# EAGLE design 606_outin_ichigojam (EAGLE 8.2.2)
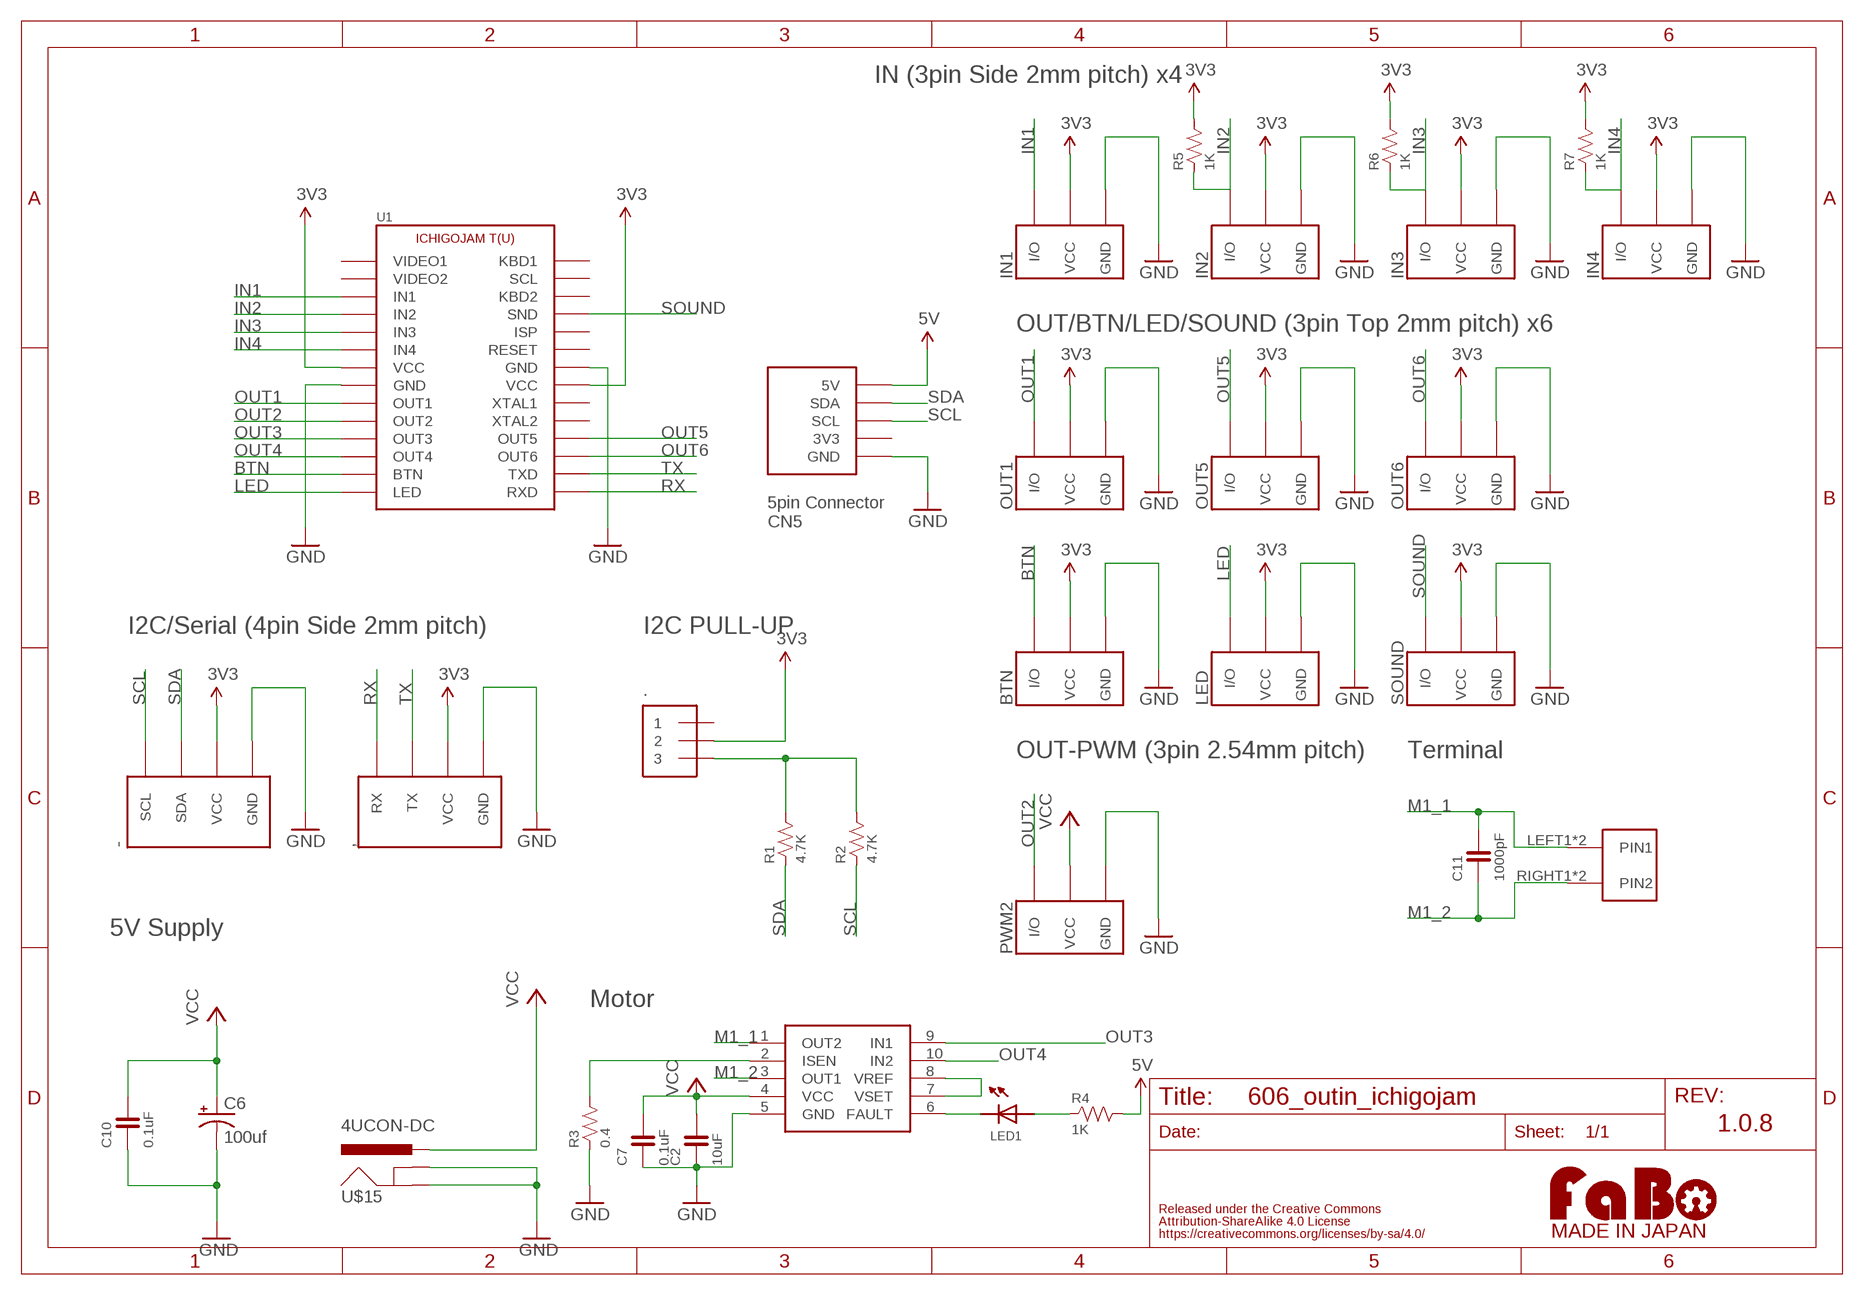
[diagram p0: schematic, sheet 1]

## Parts
,  FABO_BRICK_SERIAL-S04B-PASK-2_LONG  [FABO_BRICK_SERIAL_S04B-PASK-2_LONG]
-  FABO_BRICK_I2C-S04B-PASK-2_LONG  [FABO_BRICK_I2C_S04B-PASK-2_LONG]
.  PIN_HEADER_1X3  [PIN_1X3]
BTN  FABO_BRICK_3PIN-B03B-PASK-1  [FABO_BRICK_3PIN_B03B-PASK-1]
C2  10uF  CAPACITOR-0603  [0603]
C6  100uf  CPOL-US153CLV-0405  [153CLV-0405]
C7  0.1uF  CAPACITOR-0603  [0603]
C10  0.1uF  CAPACITOR-0603  [0603]
C11  1000pF  CAPACITOR-0603  [0603]
IN1  FABO_BRICK_3PIN-B03B-PASK-1  [FABO_BRICK_3PIN_B03B-PASK-1]
IN2  FABO_BRICK_3PIN-B03B-PASK-1  [FABO_BRICK_3PIN_B03B-PASK-1]
IN3  FABO_BRICK_3PIN-B03B-PASK-1  [FABO_BRICK_3PIN_B03B-PASK-1]
IN4  FABO_BRICK_3PIN-B03B-PASK-1  [FABO_BRICK_3PIN_B03B-PASK-1]
LED  FABO_BRICK_3PIN-B03B-PASK-1  [FABO_BRICK_3PIN_B03B-PASK-1]
LED1  LED-0603  [0603]
OUT1  FABO_BRICK_3PIN-B03B-PASK-1  [FABO_BRICK_3PIN_B03B-PASK-1]
OUT5  FABO_BRICK_3PIN-B03B-PASK-1  [FABO_BRICK_3PIN_B03B-PASK-1]
OUT6  FABO_BRICK_3PIN-B03B-PASK-1  [FABO_BRICK_3PIN_B03B-PASK-1]
PWM2  FABO_BRICK_3PIN-HEADER  [FABO_BRICK_3PIN_HEADER]
R1  4.7K  RESISTOR-0603  [0603]
R2  4.7K  RESISTOR-0603  [0603]
R3  0.4  RESISTOR-0603  [0603]
R4  1K  RESISTOR-0603  [0603]
R5  1K  RESISTOR-0603  [0603]
R6  1K  RESISTOR-0603  [0603]
R7  1K  RESISTOR-0603  [0603]
SOUND  FABO_BRICK_3PIN-B03B-PASK-1  [FABO_BRICK_3PIN_B03B-PASK-1]
U1  ICHIGOJAM_T-NOLABEL  [ICHIGOJAM_T_NOLABEL]
U$3  LOGO_FABO-M  [LOGO_FABO_MS]
U$6  DRV8832  [DRV8830]
U$12  ML-1400-S1  [ML-1400-S1]
U$15  4UCON-DC  [4UCON-DC]

## Nets
3V3: ,.VCC -.VCC ..2 BTN.VCC IN1.VCC IN2.VCC IN3.VCC IN4.VCC LED.VCC OUT1.VCC OUT5.VCC OUT6.VCC R5.2 R6.2 R7.2 SOUND.VCC U1.VCC1(VCC) U1.VCC2(VCC)
5V: R4.2 U1.5V
BTN: BTN.I/O U1.BTN
GND: ,.GND -.GND BTN.GND C2.1 C6.- C7.1 C10.1 IN1.GND IN2.GND IN3.GND IN4.GND LED.GND OUT1.GND OUT5.GND OUT6.GND PWM2.GND R3.1 SOUND.GND U1.GND1(GND) U1.GND2(GND) U1.GND3(GND) U$6.5(GND) U$15.GND1(GND) U$15.GND2(GNDBREAK)
GPIO21: LED1.CATHODE U$6.6(FAULT)
IN1: IN1.I/O U1.IN1
IN2: IN2.I/O R5.1 U1.IN2
IN3: IN3.I/O R6.1 U1.IN3
IN4: IN4.I/O R7.1 U1.IN4
LED: LED.I/O U1.LED
M1_1: C11.2 U$6.1(OUT2) U$12.LEFT1(PIN1) U$12.LEFT2(PIN1)
M1_2: C11.1 U$6.3(OUT1) U$12.RIGHT1(PIN2) U$12.RIGHT2(PIN2)
N$1: ..3 R1.2 R2.2
N$2: R3.2 U$6.2(ISEN)
N$3: U$6.7(VSET) U$6.8(VREF)
N$4: LED1.ANODE R4.1
OUT1: OUT1.I/O U1.OUT1
OUT2: PWM2.I/O U1.OUT2
OUT3: U1.OUT3 U$6.9(IN1)
OUT4: U1.OUT4 U$6.10(IN2)
OUT5: OUT5.I/O U1.OUT5
OUT6: OUT6.I/O U1.OUT6
RX: ,.RX U1.RXD
SCL: -.SCL R2.1 U1.SCL2(SCL)
SDA: -.SDA R1.1 U1.SDA
SOUND: SOUND.I/O U1.SND
TX: ,.TX U1.TXD
VCC: C2.2 C6.+ C7.2 C10.2 PWM2.VCC U$6.4(VCC) U$15.VCC(PWR)
Unconnected: ..1 U1.3V3 U1.ISP U1.KBD1 U1.KBD2 U1.RST(RESET) U1.SCL1(SCL) U1.VIDEO1 U1.VIDEO2 U1.XTAL1 U1.XTAL2

## Notes on the sheet
- IN (3pin Side 2mm pitch) x4
- OUT/BTN/LED/SOUND (3pin Top 2mm pitch) x6
- 5pin Connector
  CN5
- I2C/Serial (4pin Side 2mm pitch) | I2C PULL-UP
- OUT-PWM (3pin 2.54mm pitch) | Terminal
- 5V Supply
- Motor
- 1.0.8

## Library data of the parts
, = FaBo-Template:FABO_BRICK_SERIAL: FaBo Brick Serial
- = FaBo-Template:FABO_BRICK_I2C: FaBo Brick I2C
. = FaBo-PIN:PIN_HEADER_1X3
BTN IN1-IN4 LED OUT1 OUT5 OUT6 PWM2 SOUND = FaBo-Template:FABO_BRICK_3PIN: FaBo Brick 3pin
C2 C7 C10 C11 = FaBo-Capacitor:CAPACITOR: CAPACITOR
C6 = resistor:CPOL-US: POLARIZED CAPACITOR, American symbol
LED1 = FaBo-LED:LED
R1-R7 = FaBo-Resistors:RESISTOR: RESISTOR
U1 = FaBo-Boards:ICHIGOJAM_T
U$3 = FaBo-etc:LOGO_FABO
U$6 = FaBo-Motor:DRV8832
U$12 = FaBo-Terminal:ML-1400-S1
U$15 = FaBo-Supply:4UCON-DC

## Board
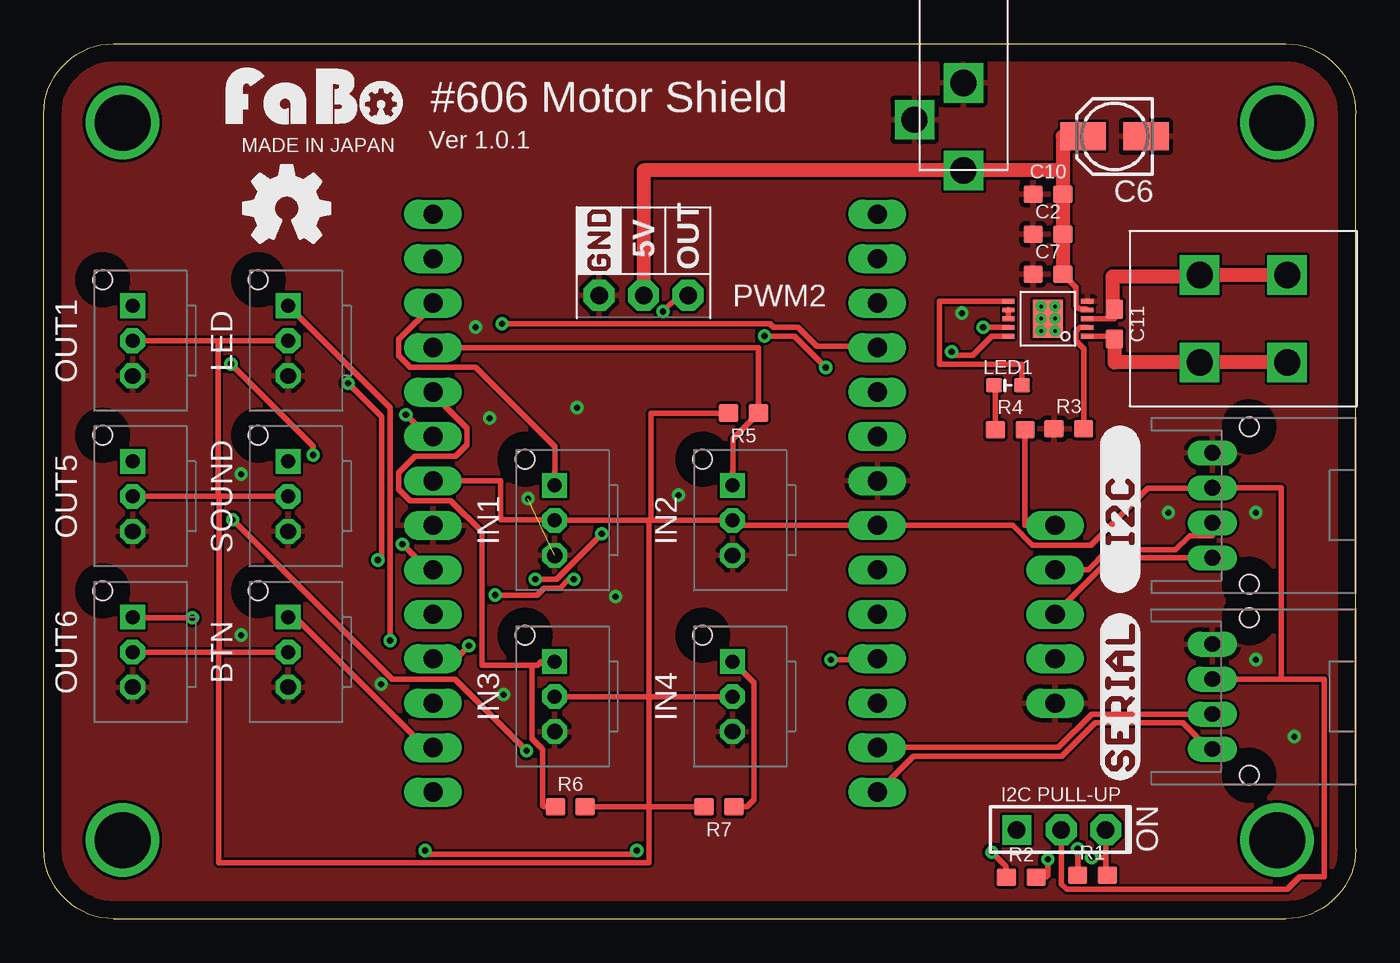
[diagram p1: board, top side]
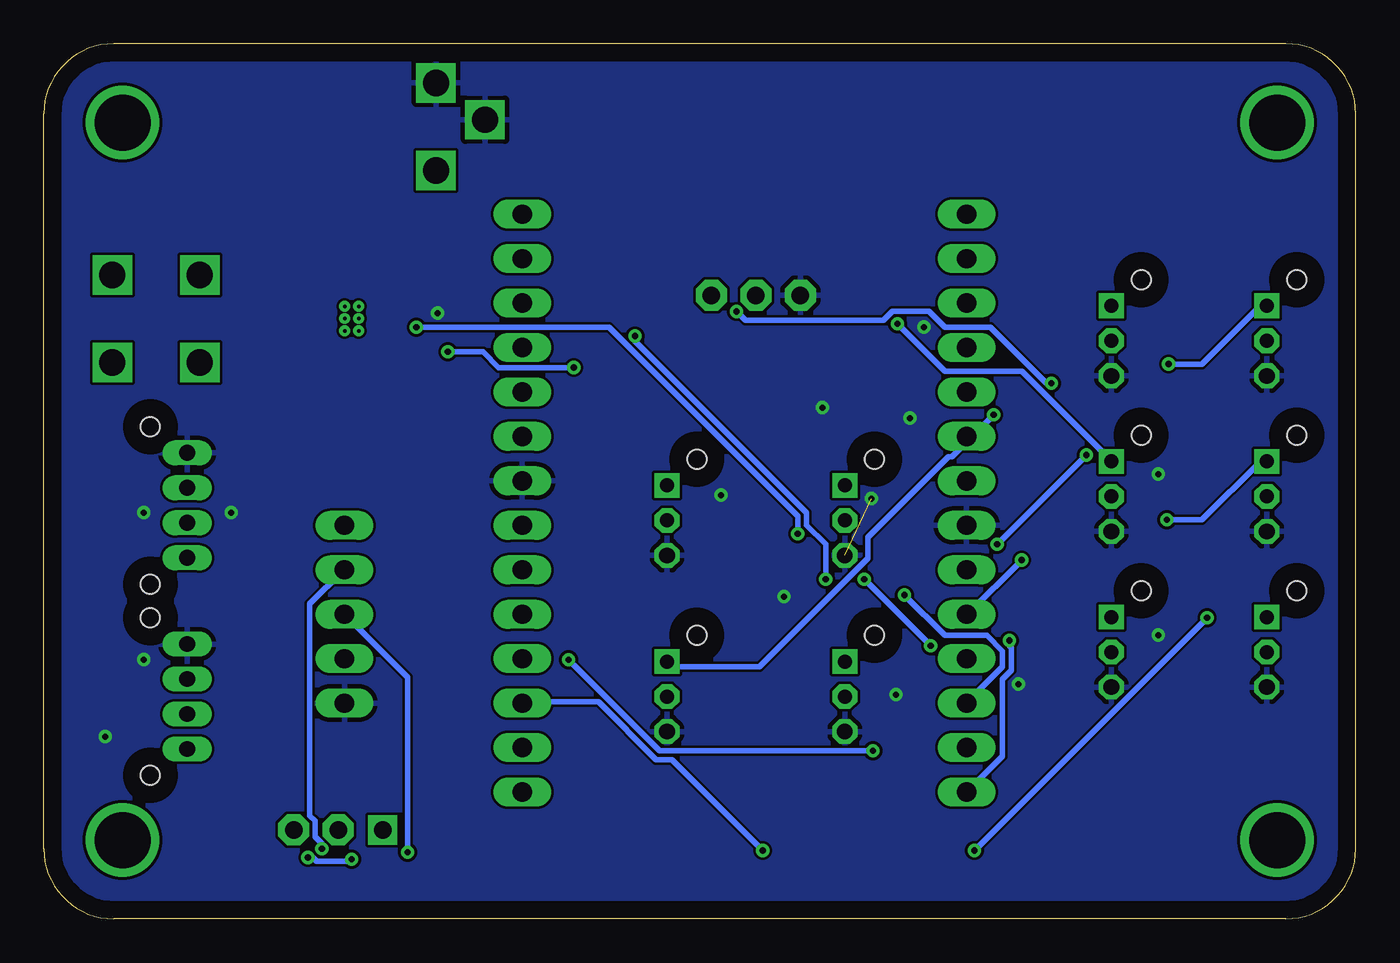
[diagram p2: board, bottom side, seen from below]

Size 75 x 50 mm. Coordinates in mm from the lower left corner, seen from the top.
Copper layers (1*16): Top 0.035mm / dielectric 1.5mm / Bottom 0.035mm
Design rules "default": minimum track width 6mil, minimum drill 0.35mm, track to track 6mil, track to pad 6mil, pad to pad 6mil, via to via 6mil, smd to smd 6mil, copper to edge 40mil, drill to drill 6mil, minimum pad ring 10mil, minimum via ring 8mil, stop-mask expansion 4mil, vias tented up to drill 0mil, thermal gap 10mil

### Footprints (pad centres in the part's own frame; a part is rotated, then mirrored left to right if it is on the bottom)
FABO_BRICK_SERIAL_S04B-PASK-2_LONG = drill 0.9 pad 1.422 long: GND -3,0; RX 3,0; TX 1,0; VCC -1,0 | hole 1.1: 4.5,2.1; -4.5,2.1
FABO_BRICK_I2C_S04B-PASK-2_LONG = drill 0.9 pad 1.422 long: GND -3,0; SCL 3,0; SDA 1,0; VCC -1,0 | hole 1.1: 4.5,2.1; -4.5,2.1
PIN_1X3 = drill 1 pad 1.676 square: 1 -2.54,0 | drill 1 pad 1.778 octagon: 2 0,0; 3 2.54,0
FABO_BRICK_3PIN_B03B-PASK-1 = drill 0.9 pad 1.422 octagon: GND -2,0 | drill 0.8 pad 1.422 square: I/O 2,0 | drill 0.8 pad 1.422 octagon: VCC 0,0 | hole 1.1: 3.5,1.7
0603 = smd 1.1 x 1: 1 -0.85,0; 2 0.85,0
153CLV-0405 = smd 2.6 x 1.6: + 1.8,0; - -1.8,0
0603' = smd 0.9 x 0.8: ANODE -0.8,0; CATHODE 0.8,0
FABO_BRICK_3PIN_HEADER = drill 1 pad 1.778 octagon: GND -2.54,0; I/O 2.54,0; VCC 0,0
ICHIGOJAM_T_NOLABEL = drill 1.1 long: 3V3 57.81,14.86; 5V 57.81,22.48; BTN 22.25,9.78; GND1 22.25,22.48; GND2 47.65,25.02; GND3 57.81,12.32; IN1 22.25,35.18; IN2 22.25,32.64; IN3 22.25,30.1; IN4 22.25,27.56; ISP 47.65,30.1; KBD1 47.65,40.26; KBD2 47.65,35.18; LED 22.25,7.24; OUT1 22.25,19.94; OUT2 22.25,17.4; OUT3 22.25,14.86; OUT4 22.25,12.32; OUT5 47.65,14.86; OUT6 47.65,12.32; RST 47.65,27.56; RXD 47.65,7.24; SCL1 47.65,37.72; SCL2 57.81,17.4; SDA 57.81,19.94; SND 47.65,32.64; TXD 47.65,9.78; VCC1 22.25,25.02; VCC2 47.65,22.48; VIDEO1 22.25,40.26; VIDEO2 22.25,37.72; XTAL1 47.65,19.94; XTAL2 47.65,17.4 | drill 3.2: P$1 4.5,45.5; P$2 70.5,45.5; P$3 70.5,4.5; P$4 4.5,4.5
DRV8830 = smd 0.27 x 0.7: 1 -1,-2.24; 2 -0.5,-2.24; 3 0,-2.24; 4 0.5,-2.24; 5 1,-2.24; 6 1,2.26; 7 0.5,2.26; 8 0,2.26; 9 -0.5,2.26; 10 -1,2.26 | smd 2.18 x 1.72: P$1 0,0
ML-1400-S1 = drill 1.5 square: LEFT1 -2.5,2.5; LEFT2 -2.5,-2.5; RIGHT1 2.5,2.5; RIGHT2 2.5,-2.5
4UCON-DC = drill 1.5 square: GND1 0.5,0; GND2 2.6,-2.8; VCC 5.5,0

### Placement (x,y rotation side)
,  66.8,12.7 270 top
-  66.8,23.62 270 top
.  58.17,5.08 0 top
BTN  13.97,15.24 90 top
C2  57.4,39.12 0 top
C6  61.21,44.7 180 top
C7  57.4,36.83 0 top
C10  57.4,41.4 0 top
C11  61.21,33.99 270 top
IN1  29.21,22.76 90 top
IN2  39.37,22.76 90 top
IN3  29.21,12.7 90 top
IN4  39.37,12.7 90 top
LED  13.97,33.02 90 top
LED1  [0603']  55.12,30.48 0 top
OUT1  5.08,33.02 90 top
OUT5  5.08,24.13 90 top
OUT6  5.08,15.24 90 top
PWM2  34.29,35.62 0 top
R1  59.94,2.48 0 top
R2  55.88,2.38 0 top
R3  58.6,27.99 0 top
R4  55.24,27.94 0 top
R5  40,28.9 180 top
R6  30.1,6.4 0 top
R7  38.6,6.4 180 top
SOUND  13.97,24.13 90 top
U1  0,0 0 top
U$2  [LOGO_OSHW_M]  13.9,40.6 0 top
U$3  15.47,45.02 0 top
U$4  [LOGO_SILK_SERIAL2]  62.7,12.7 90 top
U$5  [LOGO_SILK_I2C]  62.7,23.4 90 top
U$6  57.4,34.29 90 top
U$7  [LOGO_SILK_GND]  33.01,36.85 90 top
U$12  68.58,34.29 90 top
U$15  52.58,48.26 270 top

### Tracks (layer width: path | path; a pad name or v marks a point on that pad's centre or on a via)
3V3
  Top 0.305: 34.6,22.76 IN1.VCC 29.21,22.8 26.1,22.8 26.1,25.02 U1.VCC1 | 34.7,22.76 IN2.VCC 39.37,22.48 U1.VCC2 55.39,22.48 56.52,21.35 59.85,21.35 63.1,24.6 66.8,24.6 -.VCC 70.74,24.62 70.74,13.7 | 34.6,22.76 34.6,12.7 | IN4.VCC 34.6,12.7 | 34.6,12.7 IN3.VCC | 34.6,6.4 34.6,12.7 | 34.6,6.4 R6.2 | 34.6,6.4 R7.2 | 34.6,22.76 34.7,22.76 | 34.7,22.76 34.7,28.9 R5.2 | 9.97,33.02 OUT1.VCC | 9.97,33.02 LED.VCC | SOUND.VCC 10.02,24.13 | 9.97,24.13 OUT5.VCC | OUT6.VCC 10,15.24 | 10.02,15.24 BTN.VCC | 10,15.24 10.02,15.24 | 10.02,15.24 10.02,24.13 | 10.02,24.13 9.97,24.13 | 9.97,24.13 9.97,33.02 | 10,15.24 10,3.2 34.6,3.2 34.6,6.4 | 70.74,13.7 ,.VCC | 70.74,13.7 73.2,13.7 73.2,2.4 71.81,2.4 71.08,1.67 58.48,1.67 58.17,1.98 ..2
5V
  Top 0.305: U1.5V 56.09,22.48 R4.2
BTN
  Top 0.305: U1.BTN 22.2,9.8 21.8,9.8 14.4,17.2 14,17.2 BTN.I/O
GND  (via drill 0.35)  (1 unrouted)
  other vias: 30.48,29.21 25.48,28.61 11.28,25.41 11.28,16.21 19.28,13.41 32.68,18.41 27.68,24.01 26.28,12.81 36.28,24.21 52.48,34.61 64.28,23.21 69.28,23.21 71.48,10.41 69.28,14.81 24.68,33.81
  pour Top: 0,0 74.93,0 74.93,50.8 0,50.8
  pour Bottom: 0,0 74.93,0 74.93,50.8 0,50.8
GPIO21
  Top 0.305: U$6.6 51.2,35.29 51.2,31.7 55.92,31.7 LED1.CATHODE
IN1
  Top 0.305: IN1.I/O 29.21,25.53 29.23,25.55 29.23,26.97 24.69,31.51 20.96,31.51 20.3,32.17 20.3,33.11 22.25,35.06 U1.IN1
IN2
  Top 0.305: U1.IN2 40.85,32.64 R5.1 39.39,27.44 39.39,25.55 39.37,25.53 IN2.I/O
IN3
  Top 0.305: IN3.I/O 28.44,14.7 28.22,14.48 27.9,14.48 | U1.IN3 22.25,29.98 24.2,28.03 24.2,27.09 23.54,26.43 21.24,26.43 20.3,25.49 20.3,24.55 20.96,23.89 23.26,23.89 25.05,22.1 25.05,14.48 27.9,14.48 | 27.9,14.48 27.9,10.3 28.5,9.7 28.5,6.5 28.6,6.4 R6.1
IN4  (via drill 0.35)
  Top 0.305: v20.7,28.8 21.9,27.6 22.2,27.6 U1.IN4 | R7.1 40.2,6.4 40.6,6.8 40.6,13.5 39.4,14.7 IN4.I/O
  Bottom 0.305: v20.7,28.8 23.1,26.4 23.3,26.4 27.9,21.8 27.9,20.6 34.1,14.4 39,14.4 39.3,14.7 IN4.I/O
LED  (via drill 0.35)
  Top 0.305: v19.8,15.9 19.8,29.2 14,35 LED.I/O
  Bottom 0.305: v19.8,15.9 19.8,15.6 19.7,15.5 19.7,14.2 20.2,13.7 20.2,9.3 22.2,7.3 U1.LED
M1_1
  Top 0.305: U$6.1 61.21,33.29 C11.2
  Top 0.813: U$12.LEFT2 U$12.LEFT1 61.21,31.79 C11.2
M1_2
  Top 0.305: U$6.3 61.21,34.29 C11.1
  Top 0.813: 66.52,36.79 U$12.RIGHT2 | 66.52,36.79 U$12.RIGHT1 | C11.1 61.1,34.84 61.1,36.7 66.52,36.7 66.52,36.79
N$1  (via drill 0.35)
  Top 0.305: R1.2 60.71,2.48 60.71,3.5 | 60.71,3.5 ..3 | v59.9,3.5 60.71,3.5 | v57.4,3.4 57.4,2.5 57.3,2.4 56.8,2.4 R2.2
  Bottom 0.305: v59.9,3.5 59.6,3.5 59.4,3.3 57.5,3.3 v57.4,3.4
N$2
  Top 0.305: R3.2 59.45,32.57 58.99,33.03 58.99,33.55 59.23,33.79 U$6.2
N$3
  Top 0.305: U$6.7 U$6.8
N$4
  Top 0.305: LED1.ANODE 54.4,30.48 R4.1
N$5  (via drill 0.2)
  other vias: 57,35
N$6  (via drill 0.2)
  other vias: 57.8,35
N$7  (via drill 0.2)
  other vias: 57.8,34.3
N$8  (via drill 0.2)
  other vias: 57.8,33.6
N$9  (via drill 0.2)
  other vias: 57,34.3
N$10  (via drill 0.2)
  other vias: 57,33.6
OUT1  (via drill 0.35)
  Top 0.305: v20.5,21.4 21.9,20 22.2,20 U1.OUT1 | v15.4,26.5 15.4,27 v10.7,31.7
  Bottom 0.305: v15.4,26.5 v20.5,21.4 | v10.7,31.7 8.8,31.7 5.5,35 5.1,35 OUT1.I/O
OUT2  (via drill 0.35)
  Top 0.305: v35.4,34.7 36.3,35.6 36.8,35.6 PWM2.I/O | v17.4,30.6 19.3,28.7 19.3,20.7 v19.1,20.5
  Bottom 0.305: v35.4,34.7 34.9,34.2 27,34.2 26.5,34.7 24.4,34.7 23.5,33.8 20.9,33.8 17.7,30.6 v17.4,30.6 | v19.1,20.5 22.2,17.4 U1.OUT2
OUT3  (via drill 0.35)
  Top 0.305: v24.3,15.6 23.6,14.9 22.3,14.9 U1.OUT3 | v28.1,19.4 29.3,19.4 v31.9,22 | v53.7,33.8 55.1,33.8 U$6.9
  Bottom 0.305: v28.1,19.4 v24.3,15.6 | v31.9,22 31.9,23 42.7,33.8 v53.7,33.8
OUT4  (via drill 0.35)
  Top 0.305: v41.2,33.3 42.9,33.3 v44.7,31.5 | v30.3,19.4 30,19.4 29.5,18.9 28.6,18.9 28.2,18.5 v25.8,18.5 | v51.9,32.4 52.1,32.2 53.1,32.2 54.2,33.3 55.1,33.3 U$6.10
  Bottom 0.305: v41.2,33.3 41.2,33 31.4,23.2 31.4,22.5 30.3,21.4 v30.3,19.4 | v25.8,18.5 23.5,16.2 21.1,16.2 20.2,15.3 20.2,14.4 22.2,12.4 U1.OUT4 | v51.9,32.4 49.9,32.4 49,31.5 v44.7,31.5
OUT5  (via drill 0.35)
  Top 0.305: v45,14.8 47.6,14.8 U1.OUT5 | v27.6,9.6 23.5,13.7 19.9,13.7 v10.8,22.8
  Bottom 0.305: v45,14.8 39.8,9.6 v27.6,9.6 | v10.8,22.8 8.8,22.8 5.5,26.1 5.1,26.1 OUT5.I/O
OUT6  (via drill 0.35)
  Top 0.305: v8.5,17.2 5.1,17.2 OUT6.I/O | v21.8,3.9 22,3.7 33.7,3.7 v33.9,3.9
  Bottom 0.305: v21.8,3.9 v8.5,17.2 | v33.9,3.9 39.1,9.1 40,9.1 43.3,12.4 47.6,12.4 U1.OUT6
RX
  Top 0.305: ,.RX 66.6,9.7 65.1,11.2 60.1,11.2 58.2,9.3 49.7,9.3 47.7,7.3 U1.RXD
SCL  (via drill 0.35)
  Top 0.305: -.SCL 61.03,20.62 U1.SCL2 | v54.2,3.8 55,3 55,2.4 R2.1
  Bottom 0.305: v54.2,3.8 54.2,13.8 U1.SCL2
SDA  (via drill 0.35)
  Top 0.305: U1.SDA 59.7,19.94 60.84,21.08 64.68,21.08 65.5,21.9 66.8,21.9 -.SDA | v59.1,4 59.1,2.5 R1.1
  Bottom 0.305: v59.1,4 59.1,4.3 59.5,4.7 59.5,5.6 59.8,5.9 59.8,18 57.9,19.9 U1.SDA
SOUND  (via drill 0.35)
  Top 0.305: v26.2,34 41.5,34 41.7,33.8 43.1,33.8 44.2,32.7 47.6,32.7 U1.SND
  Bottom 0.305: v26.2,34 23.5,31.3 19.1,31.3 14,26.2 SOUND.I/O
TX
  Top 0.305: ,.TX 59.9,11.7 58,9.8 47.7,9.8 U1.TXD
VCC
  Top 0.305: U$6.4 59.58,34.85 59.17,34.85 58.99,35.03 58.99,36.09 C7.2
  Top 0.813: 58.25,42.76 U$15.VCC 34.29,42.76 PWM2.VCC | 58.25,42.76 C10.2 C2.2 C7.2 | C6.+ 58.25,44.7 58.25,42.76

### Text on the board
tPlace: #606 Motor Shield | MADE IN JAPAN | Ver 1.0.1 | 5V | OUT | I2C PULL-UP | ON